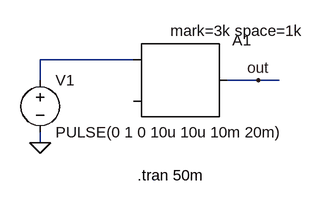
[diagram p0: schematic modulator.asc]
modulator.asc, the LTspice schematic file:
Version 4
SHEET 1 880 680
WIRE 0 208 -144 208
WIRE -144 240 -144 208
WIRE 192 240 144 240
WIRE 224 240 192 240
WIRE -144 336 -144 320
FLAG -144 336 0
FLAG 192 240 out
SYMBOL SpecialFunctions\\modulate 0 208 R0
WINDOW 3 57 -44 Left 0
SYMATTR InstName A1
SYMATTR Value mark=3k space=1k
SYMBOL voltage -144 224 R0
WINDOW 123 0 0 Left 0
WINDOW 39 0 0 Left 0
SYMATTR InstName V1
SYMATTR Value PULSE(0 1 0 10u 10u 10m 20m)
TEXT 6 386 Left 0 !.tran 50m

The netlist it stands for:
* modulator.asc
A1 N001 0 0 0 0 0 out 0 MODULATOR mark=3k space=1k
V1 N001 0 PULSE(0 1 0 10u 10u 10m 20m)
.tran 50m
.backanno
.end